# Altium schematic sheet Microcontroller.SchDoc
size A4
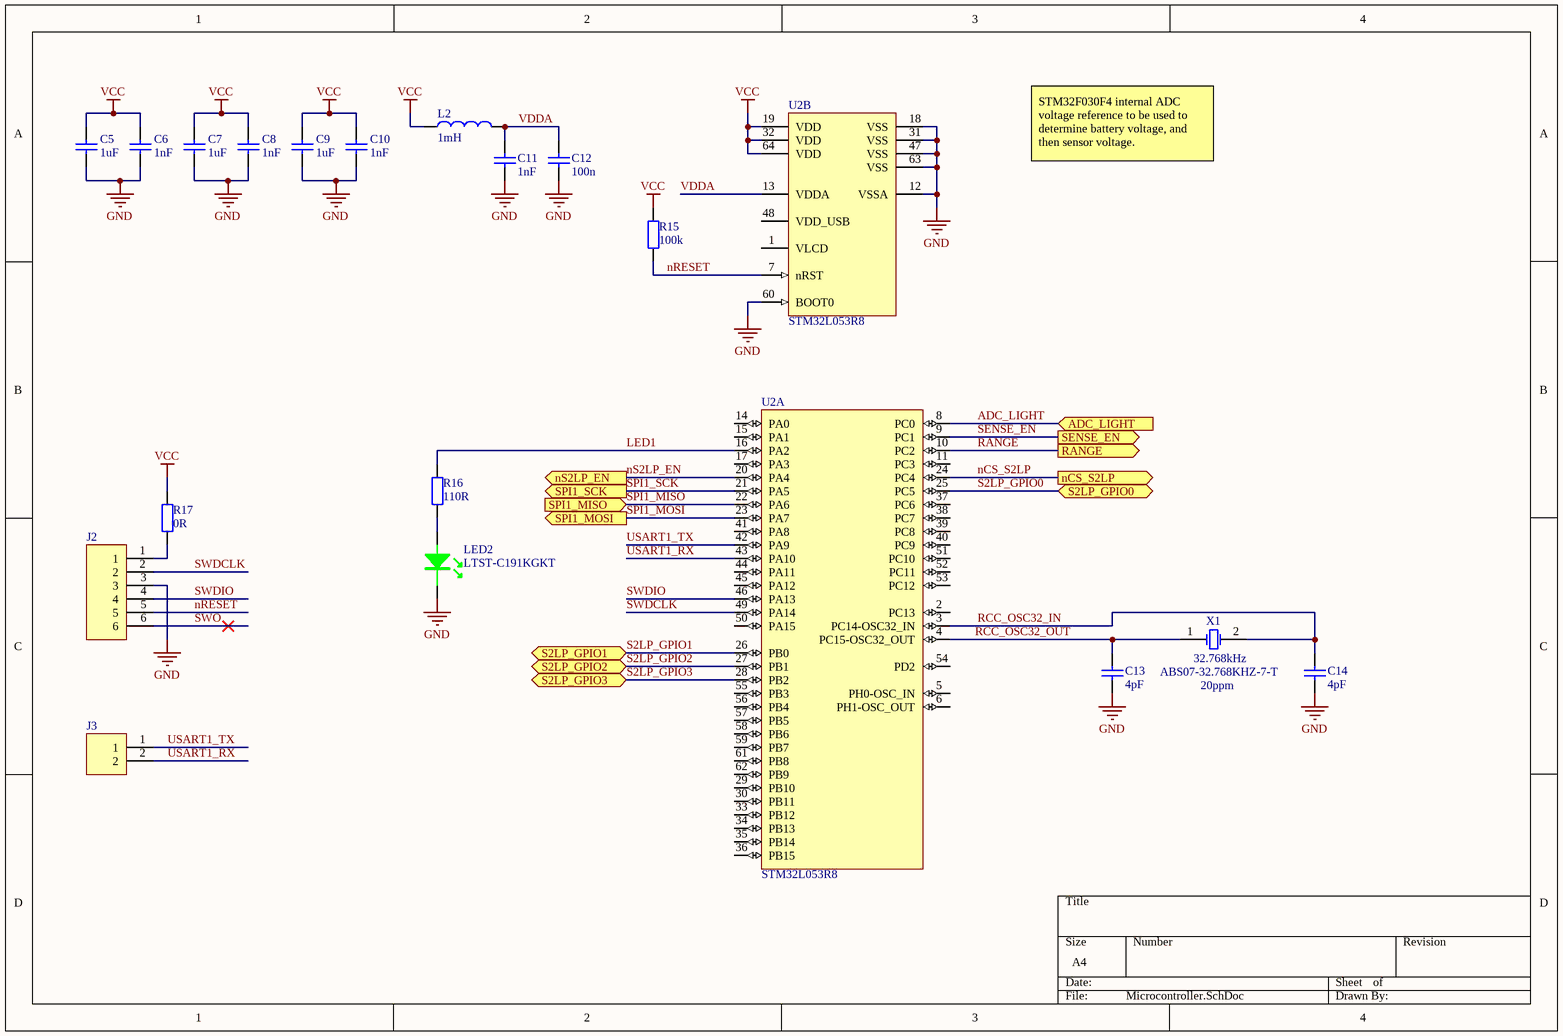
[diagram p0: Microcontroller.SchDoc]

## Parts
C5  Capacitance: 1uF  [C0603]
C6  1nF  [C0603]
C7  Capacitance: 1uF  [C0603]
C8  1nF  [C0603]
C9  Capacitance: 1uF  [C0603]
C10  1nF  [C0603]
C11  1nF  [C0603]
C12  100n  [C0603]
C13  4pF  [C0603]
C14  4pF  [C0603]
J2  (no value)  [HEADER_6WAY]
J3  (no value)  [HEADER_2WAY]
L2  Inductance: 1mH  [TAIYOYUDEN_CB2518T102K]  (hidden comment: IND)
LED2  LTST-C191KGKT  [LITEON_LTST-C191KGKT]
R15  100k  [R0603]
R16  110R  [R0603]
R17  0R  [R0603]
U2  STM32L053R8  [ST_STM32L053R8Tx]  (parts A,B of 2)
X1  32.768kHz  Manufacturer Part Number: ABS07-32.768KHZ-7-T  Frequency Tolerance: 20ppm  [Abracon_ABS07]

## Ports
ADC_LIGHT (in), nCS_S2LP (out), nS2LP_EN (out), RANGE (out), S2LP_GPIO0 (bidir), S2LP_GPIO1 (bidir), S2LP_GPIO2 (bidir), S2LP_GPIO3 (bidir), SENSE_EN (out), SPI1_MISO (in), SPI1_MOSI (out), SPI1_SCK (out)

## Nets
GND: C5.1 C6.2 C7.1 C8.2 C9.1 C10.2 C11.2 C12.1 C13.1 C14.1 J2.3 LED2.K U2.12(VSSA) U2.18(VSS) U2.31(VSS) U2.47(VSS) U2.60(BOOT0) U2.63(VSS)
VCC: C5.2 C6.1 C7.2 C8.1 C9.2 C10.1 L2.2 R15.1 R17.2 U2.19(VDD) U2.32(VDD) U2.64(VDD)
ADC_LIGHT: U2.8(PC0) ; port ADC_LIGHT
LED1: R16.1 U2.16(PA2)
nCS_S2LP: U2.24(PC4) ; port nCS_S2LP
nRESET: J2.5 R15.2 U2.7(nRST)
nS2LP_EN: U2.20(PA4) ; port nS2LP_EN
RANGE: U2.10(PC2) ; port RANGE
RCC_OSC32_IN: C14.2 U2.3(PC14-OSC32_IN) X1.2(OSC2)
RCC_OSC32_OUT: C13.2 U2.4(PC15-OSC32_OUT) X1.1(OSC1)
S2LP_GPIO0: U2.25(PC5) ; port S2LP_GPIO0
S2LP_GPIO1: U2.26(PB0) ; port S2LP_GPIO1
S2LP_GPIO2: U2.27(PB1) ; port S2LP_GPIO2
S2LP_GPIO3: U2.28(PB2) ; port S2LP_GPIO3
SENSE_EN: U2.9(PC1) ; port SENSE_EN
SPI1_MISO: U2.22(PA6) ; port SPI1_MISO
SPI1_MOSI: U2.23(PA7) ; port SPI1_MOSI
SPI1_SCK: U2.21(PA5) ; port SPI1_SCK
SWDCLK: J2.2 U2.49(PA14)
SWDIO: J2.4 U2.46(PA13)
SWO: J2.6
USART1_RX: J3.2 U2.43(PA10)
USART1_TX: J3.1 U2.42(PA9)
VDDA: C11.1 C12.2 L2.1 U2.13(VDDA)
NetJ2_1: J2.1 R17.1
NetLED2_A: LED2.A R16.2

Not connected (* = marked no-connect by the designer): U2 1(VLCD) 2(PC13) 5(PH0-OSC_IN) 6(PH1-OSC_OUT) 11(PC3) 14(PA0) 15(PA1) 17(PA3) 29(PB10) 30(PB11) 33(PB12) 34(PB13) 35(PB14) 36(PB15) 37(PC6) 38(PC7) 39(PC8) 40(PC9) 41(PA8) 44(PA11) 45(PA12) 48(VDD_USB) 50(PA15) 51(PC10) 52(PC11) 53(PC12) 54(PD2) 55(PB3) 56(PB4) 57(PB5) 58(PB6) 59(PB7) 61(PB8) 62(PB9)

## Notes on the sheet
- STM32F030F4 internal ADC voltage reference to be used to determine battery voltage, and then sensor voltage.

## Library data of the parts
C5 C7 C9 = CAP: Manufacturer: Yageo; Manufacturer Part Number: CC0603KRX7R9BB105; Voltage Rating: 50V
C6 C8 C10 C11 = CAP: Manufacturer: Yageo; Manufacturer Part Number: CC0603KRX7R9BB102; Voltage Rating: 50V
C12 = CAP: Manufacturer: Yageo; Manufacturer Part Number: CC0603ZRY5V9BB104
C13 C14 = CAP: Manufacturer: Yageo; Manufacturer Part Number: CC0603CRNPO9BN4R0
J2 = 6WAY
J3 = 2WAY
L2 = IND: Manufacturer: Taiyo Yuden; Manufacturer Part Number: CB2518T102K
LED2 = LED_Green: Manufacturer: Lite On; Manufacturer Part Number: LTST-C191KGKT
R15 = RES: Manufacturer: Yageo; Manufacturer Part Number: RC0603FR-07100KL; Tolerance: 1%; Footprint: *
R16 = RES: Manufacturer: Yageo; Manufacturer Part Number: RC0603FR-07110RL; Footprint: *
R17 = RES: Manufacturer: Yageo; Manufacturer Part Number: RC0603JR-070RL; Footprint: *
U2 = STM32L053R8: Manufacturer: ST; Manufacturer Part Number: STM32L053R8
X1 = ABRACON_ABS07: Crystal Oscillator; Manufacturer: Abracon; Frequency: 32.768kHz